# EAGLE design cartridge (EAGLE 6.5.0)
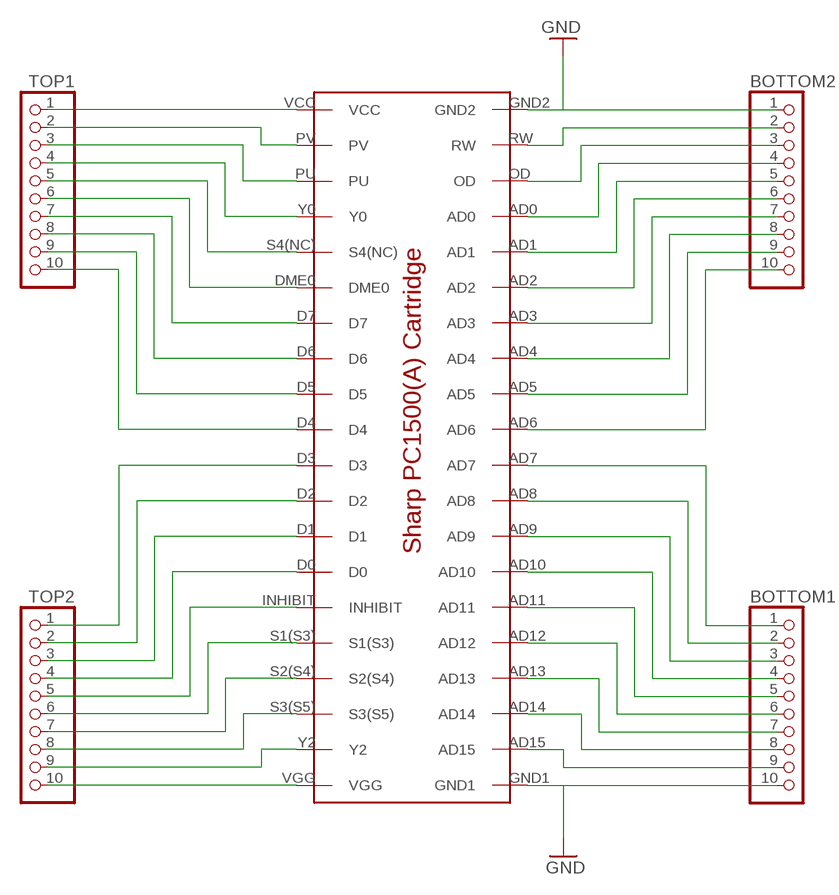
[diagram p0: schematic, sheet 1]

## Parts
BOTTOM1  PINHD-1X10  [1X10]
BOTTOM2  PINHD-1X10  [1X10]
TOP1  PINHD-1X10  [1X10]
TOP2  PINHD-1X10  [1X10]
U$1  SHARP-PC1500-CARTRIDGE  [SHARP-PC1500-CARTRIDGE]

## Nets
AD0: BOTTOM2.4 U$1.AD0
AD1: BOTTOM2.5 U$1.AD1
AD2: BOTTOM2.6 U$1.AD2
AD3: BOTTOM2.7 U$1.AD3
AD4: BOTTOM2.8 U$1.AD4
AD5: BOTTOM2.9 U$1.AD5
AD6: BOTTOM2.10 U$1.AD6
AD7: BOTTOM1.1 U$1.AD7
AD8: BOTTOM1.2 U$1.AD8
AD9: BOTTOM1.3 U$1.AD9
AD10: BOTTOM1.4 U$1.AD10
AD11: BOTTOM1.5 U$1.AD11
AD12: BOTTOM1.6 U$1.AD12
AD13: BOTTOM1.7 U$1.AD13
AD14: BOTTOM1.8 U$1.AD14
AD15: BOTTOM1.9 U$1.AD15
D0: TOP2.4 U$1.D0
D1: TOP2.3 U$1.D1
D2: TOP2.2 U$1.D2
D3: TOP2.1 U$1.D3
D4: TOP1.10 U$1.D4
D5: TOP1.9 U$1.D5
D6: TOP1.8 U$1.D6
D7: TOP1.7 U$1.D7
DME0: TOP1.6 U$1.DME0
GND: BOTTOM1.10 BOTTOM2.1 U$1.GND1 U$1.GND2
INHIBIT: TOP2.5 U$1.INHIBIT
OD: BOTTOM2.3 U$1.OD
PU: TOP1.3 U$1.PU
PV: TOP1.2 U$1.PV
RW: BOTTOM2.2 U$1.RW
S1(S3): TOP2.6 U$1.S1(S3)
S2(S4): TOP2.7 U$1.S2(S4)
S3(S5): TOP2.8 U$1.S3(S5)
S4(NC): TOP1.5 U$1.S4(NC)
VCC: TOP1.1 U$1.VCC
VGG: TOP2.10 U$1.VGG
Y0: TOP1.4 U$1.Y0
Y2: TOP2.9 U$1.Y2

## Library data of the parts
BOTTOM1 BOTTOM2 TOP1 TOP2 = pinhead:PINHD-1X10: PIN HEADER
U$1 = kaibader:SHARP-PC1500-CARTRIDGE: Sharp PC-1500(A) Cartridge Connector

## Board
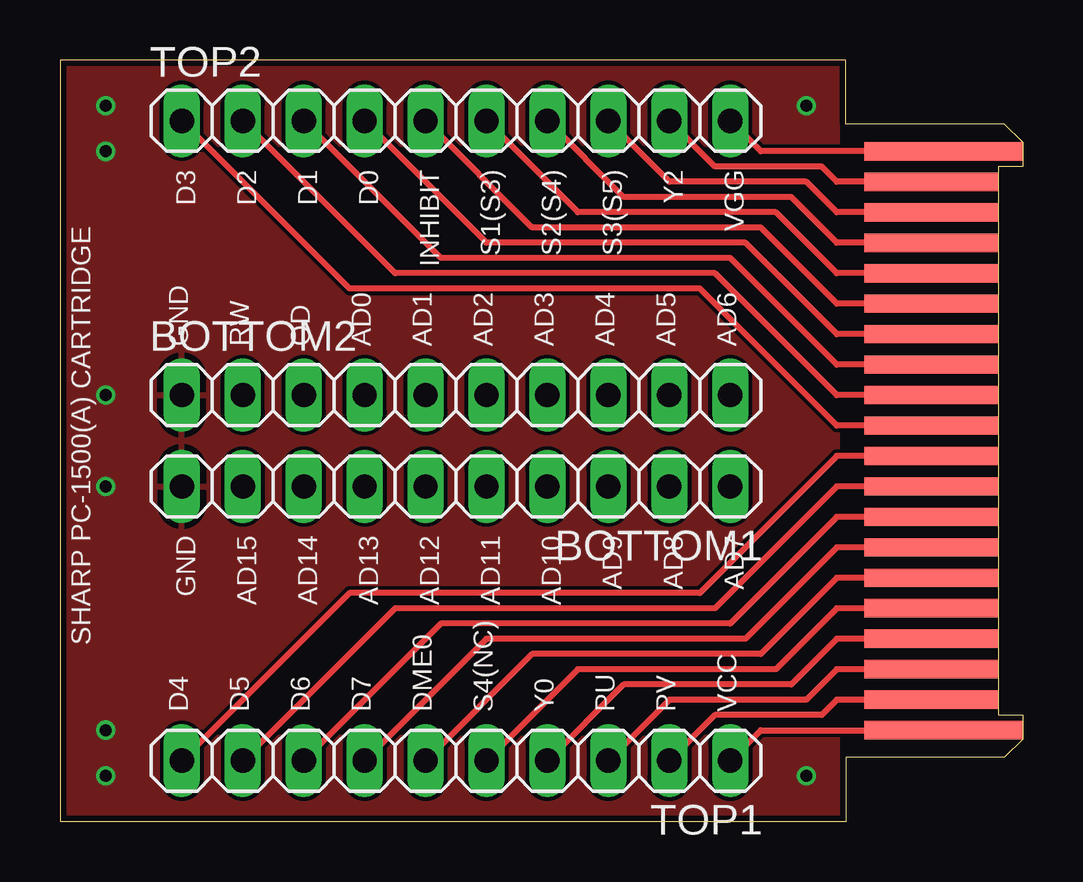
[diagram p1: board, top side]
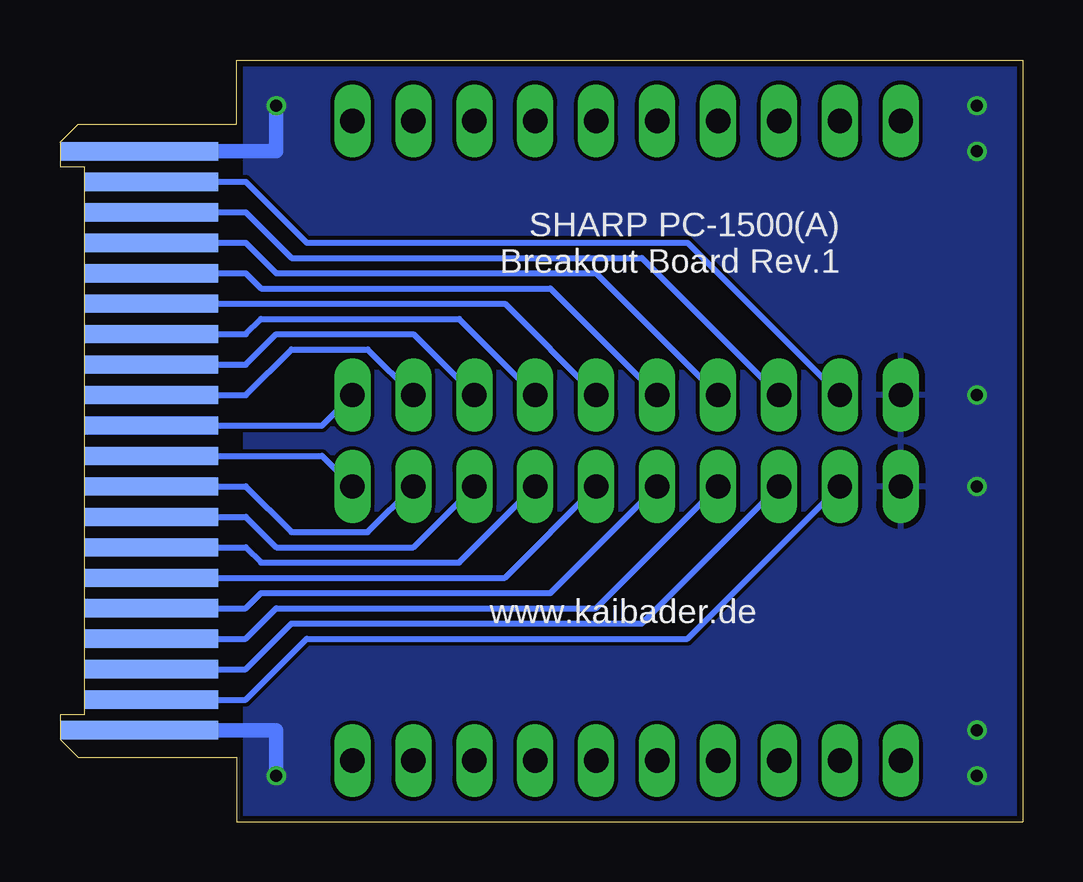
[diagram p2: board, bottom side, seen from below]

Size 40.13 x 31.75 mm. Coordinates in mm from the lower left corner, seen from the top.
Outline: 32.77,29.08 32.77,31.75 0,31.75 0,0 32.77,0 32.77,2.67
Copper layers (1*16): Top 0.035mm / dielectric 1.5mm / Bottom 0.035mm
Design rules "ITEADstudio_DRC": minimum track width 6mil, minimum drill 12mil, track to track 6mil, track to pad 6mil, pad to pad 6mil, via to via 6mil, smd to smd 0mil, copper to edge 10mil, drill to drill 10mil, minimum pad ring 10mil, minimum via ring 6mil, stop-mask expansion 2mil, vias tented up to drill 100mil, thermal gap 10mil

### Footprints (pad centres in the part's own frame; a part is rotated, then mirrored left to right if it is on the bottom)
1X10 = drill 1.016 long: 1 -11.43,0; 2 -8.89,0; 3 -6.35,0; 4 -3.81,0; 5 -1.27,0; 6 1.27,0; 7 3.81,0; 8 6.35,0; 9 8.89,0; 10 11.43,0
SHARP-PC1500-CARTRIDGE = smd 5.588 x 0.762 bottom: AD0 3.81,4.953; AD1 3.81,6.223; AD2 3.81,7.493; AD3 3.81,8.763; AD4 3.81,10.033; AD5 3.81,11.303; AD6 3.81,12.573; AD7 3.81,13.843; AD8 3.81,15.113; AD9 3.81,16.383; AD10 3.81,17.653; AD11 3.81,18.923; AD12 3.81,20.193; AD13 3.81,21.463; AD14 3.81,22.733; AD15 3.81,24.003; OD 3.81,3.683; RW 3.81,2.413 | smd 5.588 x 0.762: D0 3.81,8.763; D1 3.81,10.033; D2 3.81,11.303; D3 3.81,12.573; D4 3.81,13.843; D5 3.81,15.113; D6 3.81,16.383; D7 3.81,17.653; DME0 3.81,18.923; INHIBIT 3.81,7.493; PU 3.81,22.733; PV 3.81,24.003; S1(S3) 3.81,6.223; S2(S4) 3.81,4.953; S3(S5) 3.81,3.683; S4(NC) 3.81,20.193; Y0 3.81,21.463; Y2 3.81,2.413 | smd 6.604 x 0.762 bottom: GND1 3.302,25.273; GND2 3.302,1.143 | smd 6.604 x 0.762: VCC 3.302,25.273; VGG 3.302,1.143

### Placement (x,y rotation side)
BOTTOM1  16.51,13.97 180 top
BOTTOM2  16.51,17.78 0 top
TOP1  16.51,2.54 180 top
TOP2  16.51,29.21 0 top
U$1  40.13,29.08 180 top

### Tracks (layer width: path | path; a pad name or v marks a point on that pad's centre or on a via)
AD0
  Bottom 0.254: U$1.AD0 32.38,24.13 31.11,22.86 17.78,22.86 BOTTOM2.4
AD1
  Bottom 0.254: U$1.AD1 32.38,22.86 31.75,22.23 19.68,22.23 BOTTOM2.5
AD2
  Bottom 0.254: U$1.AD2 21.59,21.59 BOTTOM2.6
AD3
  Bottom 0.254: U$1.AD3 32.38,20.32 31.75,20.95 23.5,20.95 BOTTOM2.7
AD4
  Bottom 0.254: U$1.AD4 32.38,19.05 31.11,20.32 25.4,20.32 BOTTOM2.8
AD5
  Bottom 0.254: U$1.AD5 32.38,17.78 30.48,19.68 27.3,19.68 BOTTOM2.9
AD6
  Bottom 0.254: U$1.AD6 29.21,16.51 BOTTOM2.10
AD7
  Bottom 0.254: U$1.AD7 29.21,15.24 BOTTOM1.1
AD8
  Bottom 0.254: U$1.AD8 32.38,13.97 30.48,12.06 27.3,12.06 BOTTOM1.2
AD9
  Bottom 0.254: U$1.AD9 32.38,12.7 31.11,11.43 25.4,11.43 BOTTOM1.3
AD10
  Bottom 0.254: U$1.AD10 32.38,11.43 31.75,10.79 23.5,10.79 BOTTOM1.4
AD11
  Bottom 0.254: U$1.AD11 21.59,10.16 BOTTOM1.5
AD12
  Bottom 0.254: U$1.AD12 32.38,8.89 31.75,9.53 19.68,9.53 BOTTOM1.6
AD13
  Bottom 0.254: U$1.AD13 32.38,7.62 31.11,8.89 17.78,8.89 BOTTOM1.7
AD14
  Bottom 0.254: U$1.AD14 32.38,6.35 30.48,8.26 15.88,8.26 BOTTOM1.8
AD15
  Bottom 0.254: U$1.AD15 32.38,5.08 29.84,7.62 13.97,7.62 BOTTOM1.9
D0
  Top 0.254: U$1.D0 32.38,20.32 28.57,24.13 17.78,24.13 TOP2.4
D1
  Top 0.254: U$1.D1 32.38,19.05 27.94,23.5 15.88,23.5 TOP2.3
D2
  Top 0.254: U$1.D2 32.38,17.78 27.3,22.86 13.97,22.86 TOP2.2
D3
  Top 0.254: U$1.D3 32.38,16.51 26.67,22.23 12.06,22.23 TOP2.1
D4
  Top 0.254: U$1.D4 32.38,15.24 26.67,9.53 12.06,9.53 TOP1.10
D5
  Top 0.254: U$1.D5 32.38,13.97 27.3,8.89 13.97,8.89 TOP1.9
D6
  Top 0.254: U$1.D6 32.38,12.7 27.94,8.26 15.88,8.26 TOP1.8
D7
  Top 0.254: U$1.D7 32.38,11.43 28.57,7.62 17.78,7.62 TOP1.7
DME0
  Top 0.254: U$1.DME0 32.38,10.16 29.21,6.99 19.68,6.99 TOP1.6
GND  (via drill 0.5)
  Bottom 0.61: U$1.GND2 31.11,27.94 v31.11,29.84 | U$1.GND1 31.11,3.81 v31.11,1.91
  other vias: 1.91,29.84 1.91,27.94 1.91,17.78 1.91,13.97 1.91,3.81 1.91,1.91
  pour Bottom: 0,31.75 32.38,31.75 32.38,0 0,0
  pour Top: 0,31.75 32.38,31.75 32.38,0 0,0
INHIBIT
  Top 0.254: U$1.INHIBIT 32.38,21.59 29.21,24.77 19.68,24.77 TOP2.5
OD
  Bottom 0.254: U$1.OD 32.38,25.4 30.48,23.5 15.88,23.5 BOTTOM2.3
PU
  Top 0.254: U$1.PU 32.38,6.35 31.11,5.08 25.4,5.08 TOP1.3
PV
  Top 0.254: U$1.PV 32.38,5.08 31.75,4.45 27.3,4.45 TOP1.2
RW
  Bottom 0.254: U$1.RW 32.38,26.67 29.84,24.13 13.97,24.13 BOTTOM2.2
S1(S3)
  Top 0.254: U$1.S1(S3) 32.38,22.86 29.84,25.4 21.59,25.4 TOP2.6
S2(S4)
  Top 0.254: U$1.S2(S4) 32.38,24.13 30.48,26.04 23.5,26.04 TOP2.7
S3(S5)
  Top 0.254: U$1.S3(S5) 32.38,25.4 31.11,26.67 25.4,26.67 TOP2.8
S4(NC)
  Top 0.254: U$1.S4(NC) 32.38,8.89 29.84,6.35 21.59,6.35 TOP1.5
VCC
  Top 0.254: TOP1.1 29.21,3.81 U$1.VCC
VGG
  Top 0.254: U$1.VGG 29.21,27.94 TOP2.10
Y0
  Top 0.254: U$1.Y0 32.38,7.62 30.48,5.71 23.5,5.71 TOP1.4
Y2
  Top 0.254: U$1.Y2 32.38,26.67 31.75,27.3 27.3,27.3 TOP2.9

### Text on the board
tPlace: D3 | D2 | D1 | D0 | INHIBIT | S1(S3) | S2(S4) | S3(S5) | Y2 | VGG | GND | RW | OD | AD0 | AD1 | AD2 | AD3 | AD4 | AD5 | AD6 | GND | AD15 | AD14 | AD13 | AD12 | AD11 | AD10 | AD9 | AD8 | AD7 | SHARP PC-1500(A) CARTRIDGE | D4 | D5 | D6 | D7 | DME0 | S4(NC) | Y0 | PU | PV | VCC
bPlace: SHARP PC-1500(A) / Breakout Board Rev.1 | www.kaibader.de